# Altium schematic sheet TopBoard.SchDoc
size A; SheetNumber: 1; SheetTotal: 1
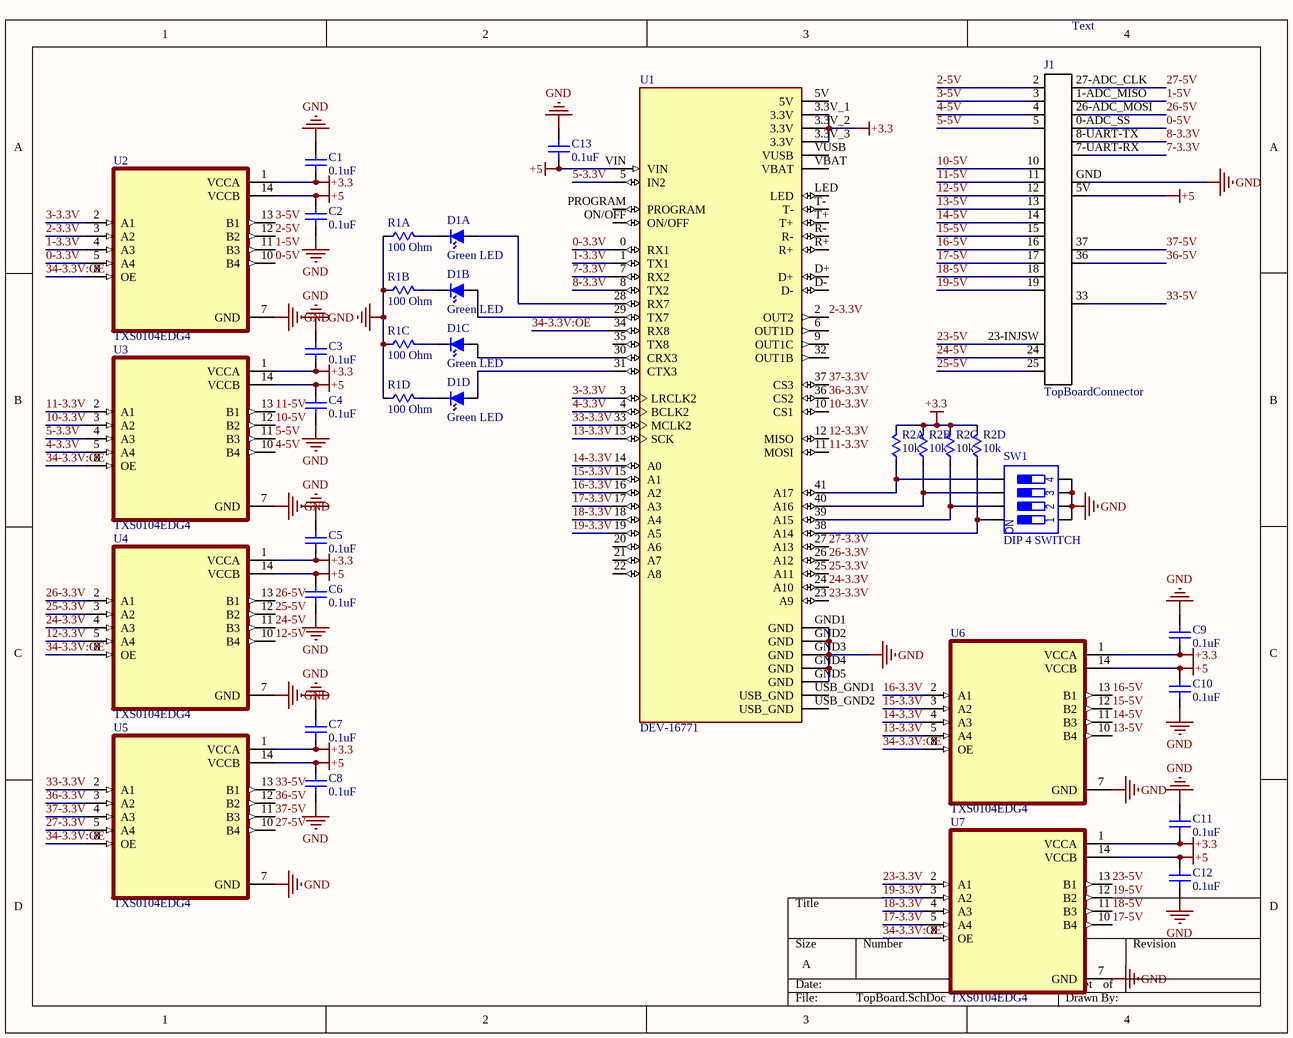
[diagram p0: TopBoard.SchDoc]

## Parts
C1  0.1uF  [0805]
C2  0.1uF  [0805]
C3  0.1uF  [0805]
C4  0.1uF  [0805]
C5  0.1uF  [0805]
C6  0.1uF  [0805]
C7  0.1uF  [0805]
C8  0.1uF  [0805]
C9  0.1uF  [0805]
C10  0.1uF  [0805]
C11  0.1uF  [0805]
C12  0.1uF  [0805]
C13  0.1uF  [0805]
D1A  Green LED  [Diode_0805]
D1B  Green LED  [Diode_0805]
D1C  Green LED  [Diode_0805]
D1D  Green LED  [Diode_0805]
J1  TopBoardConnector  [TopBoardConnector]
R1A  100 Ohm  [0805]
R1B  100 Ohm  [0805]
R1C  100 Ohm  [0805]
R1D  100 Ohm  [0805]
R2A  10k  [0805]
R2B  10k  [0805]
R2C  10k  [0805]
R2D  10k  [0805]
SW1  DIP 4 SWITCH  [DS04-254-2-04BK-SMT-TR]
U1  DEV-16771  [MODULE_DEV-16771]
U2  TXS0104EDG4  [SOIC127P600X175-14N]
U3  TXS0104EDG4  [SOIC127P600X175-14N]
U4  TXS0104EDG4  [SOIC127P600X175-14N]
U5  TXS0104EDG4  [SOIC127P600X175-14N]
U6  TXS0104EDG4  [SOIC127P600X175-14N]
U7  TXS0104EDG4  [SOIC127P600X175-14N]

## Nets
+3.3: C1.1 C3.1 C5.1 C7.1 C9.1 C11.1 R2A.2 R2B.2 R2C.2 R2D.2 U1.3.3V_1(3.3V) U1.3.3V_2(3.3V) U1.3.3V_3(3.3V) U2.1(VCCA) U3.1(VCCA) U4.1(VCCA) U5.1(VCCA) U6.1(VCCA) U7.1(VCCA)
+5: C2.2 C4.2 C6.2 C8.2 C10.2 C12.2 C13.1 J1.5V U1.VIN U2.14(VCCB) U3.14(VCCB) U4.14(VCCB) U5.14(VCCB) U6.14(VCCB) U7.14(VCCB)
GND: C1.2 C2.1 C3.2 C4.1 C5.2 C6.1 C7.2 C8.1 C9.2 C10.1 C11.2 C12.1 C13.2 J1.GND R1A.1 R1B.1 R1C.1 R1D.1 SW1.5 SW1.6 SW1.7 SW1.8 U1.GND1(GND) U1.GND2(GND) U1.GND3(GND) U1.GND4(GND) U1.GND5(GND) U2.7(GND) U3.7(GND) U4.7(GND) U5.7(GND) U6.7(GND) U7.7(GND)
0-3.3V: U1.0(RX1) U2.5(A4)
0-5V: J1.0-ADC_SS U2.10(B4)
1-3.3V: U1.1(TX1) U2.4(A3)
1-5V: J1.1-ADC_MISO U2.11(B3)
2-3.3V: U1.2(OUT2) U2.3(A2)
2-5V: J1.2 U2.12(B2)
3-3.3V: U1.3(LRCLK2) U2.2(A1)
3-5V: J1.3 U2.13(B1)
4-3.3V: U1.4(BCLK2) U3.5(A4)
4-5V: J1.4 U3.10(B4)
5-3.3V: U1.5(IN2) U3.4(A3)
5-5V: J1.5 U3.11(B3)
7-3.3V: J1.7-UART-RX(8-UART-RX) U1.7(RX2)
8-3.3V: J1.8-UART-TX U1.8(TX2)
10-3.3V: U1.10(CS1) U3.3(A2)
10-5V: J1.10 U3.12(B2)
11-3.3V: U1.11(MOSI) U3.2(A1)
11-5V: J1.11 U3.13(B1)
12-3.3V: U1.12(MISO) U4.5(A4)
12-5V: J1.12 U4.10(B4)
13-3.3V: U1.13(SCK) U6.5(A4)
13-5V: J1.13 U6.10(B4)
14-3.3V: U1.14(A0) U6.4(A3)
14-5V: J1.14 U6.11(B3)
15-3.3V: U1.15(A1) U6.3(A2)
15-5V: J1.15 U6.12(B2)
16-3.3V: U1.16(A2) U6.2(A1)
16-5V: J1.16 U6.13(B1)
17-3.3V: U1.17(A3) U7.5(A4)
17-5V: J1.17 U7.10(B4)
18-3.3V: U1.18(A4) U7.4(A3)
18-5V: J1.18 U7.11(B3)
19-3.3V: U1.19(A5) U7.3(A2)
19-5V: J1.19 U7.12(B2)
23-3.3V: U1.23(A9) U7.2(A1)
23-5V: J1.23-INJSW U7.13(B1)
24-3.3V: U1.24(A10) U4.4(A3)
24-5V: J1.24 U4.11(B3)
25-3.3V: U1.25(A11) U4.3(A2)
25-5V: J1.25 U4.12(B2)
26-3.3V: U1.26(A12) U4.2(A1)
26-5V: J1.26-ADC_MOSI U4.13(B1)
27-3.3V: U1.27(A13) U5.5(A4)
27-5V: J1.27-ADC_CLK U5.10(B4)
33-3.3V: U1.33(MCLK2) U5.2(A1)
33-5V: J1.33 U5.13(B1)
34-3.3V:OE: U1.34(RX8) U2.8(OE) U3.8(OE) U4.8(OE) U5.8(OE) U6.8(OE) U7.8(OE)
36-3.3V: U1.36(CS2) U5.3(A2)
36-5V: J1.36 U5.12(B2)
37-3.3V: U1.37(CS3) U5.4(A3)
37-5V: J1.37 U5.11(B3)
NetD1A_+: D1A.+ U1.28(RX7)
NetD1A_-: D1A.- R1A.2
NetD1B_+: D1B.+ U1.29(TX7)
NetD1B_-: D1B.- R1B.2
NetD1C_+: D1C.+ U1.30(CRX3)
NetD1C_-: D1C.- R1C.2
NetD1D_+: D1D.+ U1.31(CTX3)
NetD1D_-: D1D.- R1D.2
NetR2A_1: R2A.1 SW1.4 U1.41(A17)
NetR2B_1: R2B.1 SW1.3 U1.40(A16)
NetR2C_1: R2C.1 SW1.2 U1.39(A15)
NetR2D_1: R2D.1 SW1.1 U1.38(A14)

Not connected (* = marked no-connect by the designer): U1 5V 6(OUT1D) 9(OUT1C) 20(A6) 21(A7) 22(A8) 32(OUT1B) 35(TX8) D+ D- LED ON/OFF PROGRAM R+ R- T+ T- USB_GND1(USB_GND) USB_GND2(USB_GND) VBAT VUSB

## Notes on the sheet
- Text
- (in symbol DS04-254-2-04BK-SMT-TR) ON

## Library data of the parts
C1-C13 = Cap_0805: Cap 0805
D1A D1B D1C D1D = LG R971-KN-1: Green 570nm LED Indication - Discrete 2.2V 0805 (2012 Metric)
J1 = TopBoardConnector: Connection to the bottom board
R1A R1B R1C R1D R2A R2B R2C R2D = Res_0805: Res 0805
SW1 = DS04-254-2-04BK-SMT-TR: Manufacturer: CUI; Supplier 1: Digi-Key; Manufacturer Part Number: DS04-254-2-04BK-SMT-TR; RoHS: Yes; Stock 1: 183; Pricing 1: 1=0.66000, 10=0.63400, 25=0.61120, 100=0.52880, 250=0.48176 (USD); Supplier Part Number 1: 2223-DS04-254-2-04BK-SMT-CT-ND
U1 = DEV-16771: RT1062 Teensy 4.1 i.MX ARM Cortex-M7 MPU Embedded Evaluation Board; Value: *; Availability: Unavailable; Price: None; MP: DEV-16771; Package: None
U2-U7 = TXS0104EDG4: 4-Bit Bidirectional Voltage-Level Shifter for Open-Drain and Push-Pull Applications 14-SOIC -40 to 85; MF: Texas Instruments; Value: *; MP: TXS0104EDG4; Availability: In Stock; SnapEDA_Link: https://www.snapeda.com/parts/TXS0104EDG4/Texas+Instruments/view-part/?ref=snap; Purchase-URL: https://pricing.snapeda.com/search/part/TXS0104EDG4/?ref=eda; Check_prices: https://www.snapeda.com/parts/TXS0104EDG4/Texas+Instruments/view-part/?ref=eda; Price: None; Package: SOIC-14 Texas Instruments